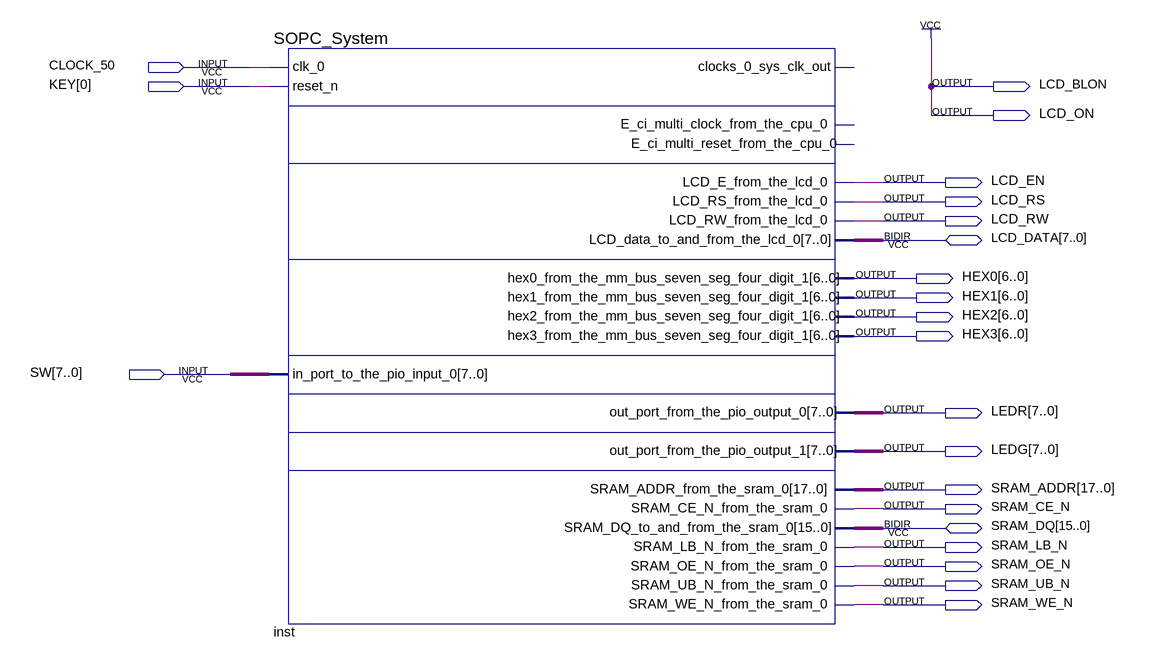
[diagram p0: schematic sheet]
// Quartus schematic firstSopc.bdf as structural Verilog: 1 symbols, 22 pins
module firstSopc (
  input  CLOCK_50,
  input  [0:0] KEY,
  input  [7:0] SW,
  inout  [7:0] LCD_DATA,
  inout  [15:0] SRAM_DQ,
  output LCD_BLON,
  output LCD_ON,
  output LCD_EN,
  output LCD_RS,
  output LCD_RW,
  output [6:0] HEX0,
  output [6:0] HEX1,
  output [6:0] HEX2,
  output [6:0] HEX3,
  output [7:0] LEDR,
  output [7:0] LEDG,
  output [17:0] SRAM_ADDR,
  output SRAM_CE_N,
  output SRAM_LB_N,
  output SRAM_OE_N,
  output SRAM_UB_N,
  output SRAM_WE_N
);

  SOPC_System inst (
    .clk_0(CLOCK_50), .reset_n(KEY[0]), .in_port_to_the_pio_input_0(SW), .LCD_E_from_the_lcd_0(LCD_EN),
    .LCD_RS_from_the_lcd_0(LCD_RS), .LCD_RW_from_the_lcd_0(LCD_RW),
    .hex0_from_the_mm_bus_seven_seg_four_digit_1(HEX0), .hex1_from_the_mm_bus_seven_seg_four_digit_1(HEX1),
    .hex2_from_the_mm_bus_seven_seg_four_digit_1(HEX2), .hex3_from_the_mm_bus_seven_seg_four_digit_1(HEX3),
    .out_port_from_the_pio_output_0(LEDR), .out_port_from_the_pio_output_1(LEDG),
    .SRAM_ADDR_from_the_sram_0(SRAM_ADDR), .SRAM_CE_N_from_the_sram_0(SRAM_CE_N),
    .SRAM_LB_N_from_the_sram_0(SRAM_LB_N), .SRAM_OE_N_from_the_sram_0(SRAM_OE_N),
    .SRAM_UB_N_from_the_sram_0(SRAM_UB_N), .SRAM_WE_N_from_the_sram_0(SRAM_WE_N),
    .LCD_data_to_and_from_the_lcd_0(LCD_DATA), .SRAM_DQ_to_and_from_the_sram_0(SRAM_DQ));  // open: clocks_0_sys_clk_out, E_ci_multi_clock_from_the_cpu_0, E_ci_multi_reset_from_the_cpu_0

  assign LCD_BLON = 1'b1;
  assign LCD_ON = 1'b1;
endmodule
